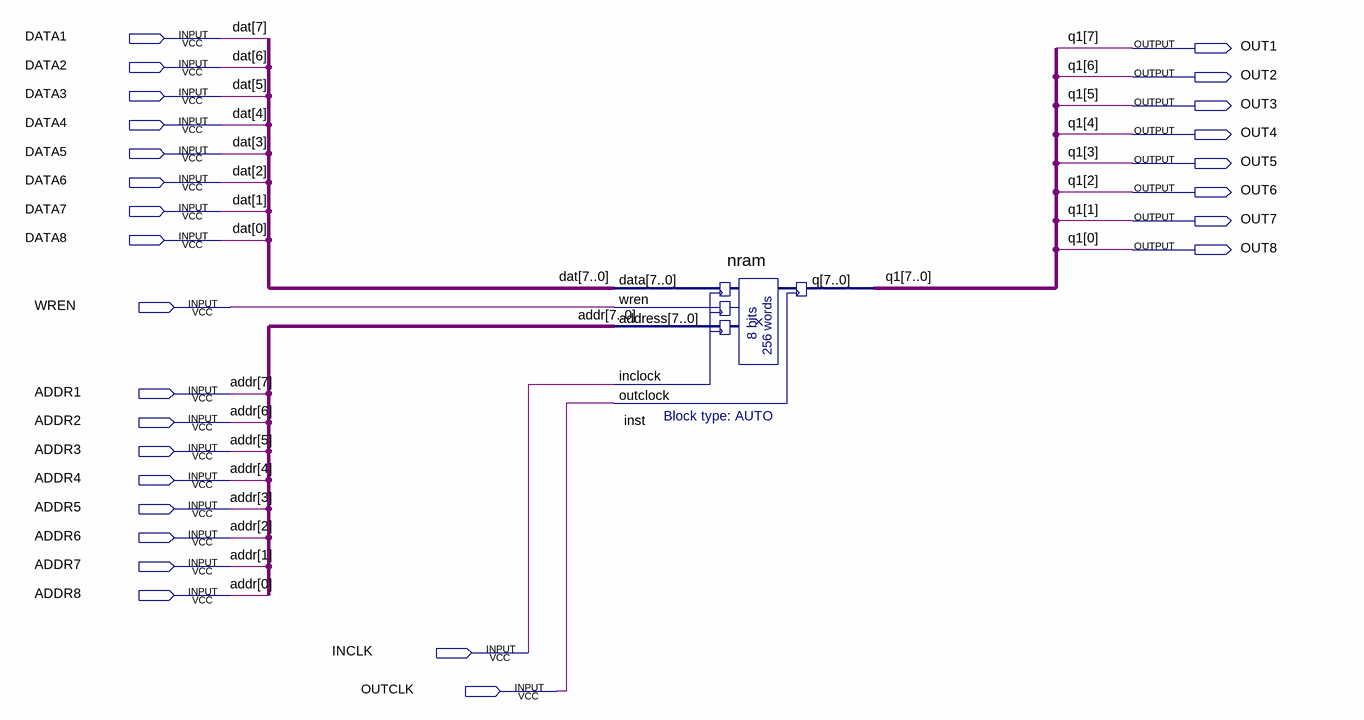
[diagram p0: schematic sheet]
// Quartus schematic A_Reg.bdf as structural Verilog: 1 symbols, 27 pins
module A_Reg (
  input  DATA1,
  input  DATA2,
  input  DATA3,
  input  DATA4,
  input  DATA5,
  input  DATA6,
  input  DATA7,
  input  DATA8,
  input  WREN,
  input  ADDR1,
  input  ADDR2,
  input  ADDR3,
  input  ADDR4,
  input  ADDR5,
  input  ADDR6,
  input  ADDR7,
  input  ADDR8,
  input  INCLK,
  input  OUTCLK,
  output OUT1,
  output OUT2,
  output OUT3,
  output OUT4,
  output OUT5,
  output OUT6,
  output OUT7,
  output OUT8
);

  nram inst (
    .data({DATA1, DATA2, DATA3, DATA4, DATA5, DATA6, DATA7, DATA8}), .wren(WREN),
    .address({ADDR1, ADDR2, ADDR3, ADDR4, ADDR5, ADDR6, ADDR7, ADDR8}), .inclock(INCLK), .outclock(OUTCLK),
    .q({OUT1, OUT2, OUT3, OUT4, OUT5, OUT6, OUT7, OUT8}));

  // Other names for the same wires on the sheet: addr (some bits) = {ADDR1, ADDR2, ADDR3, ADDR5, ADDR6, ADDR7, ADDR8};
  //   dat[7:0] = {DATA1, DATA2, DATA3, DATA4, DATA5, DATA6, DATA7, DATA8};
  //   q1[7:0] = {OUT1, OUT2, OUT3, OUT4, OUT5, OUT6, OUT7, OUT8}
endmodule
